# Altium schematic sheet Etapa_Regulación.schdoc
size 160 x 68 mm
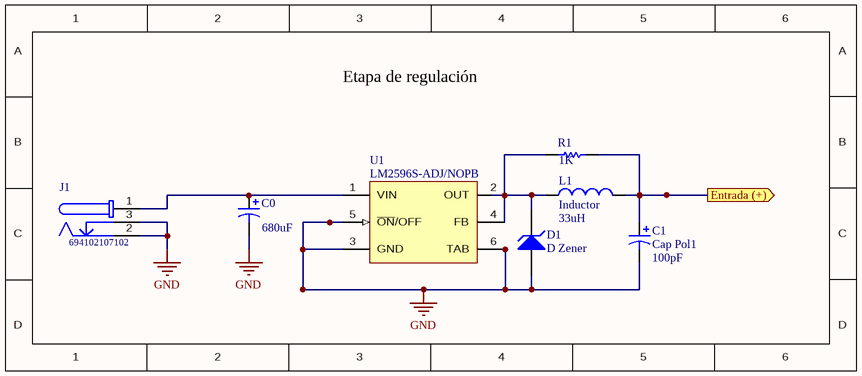
[diagram p0: Etapa_Regulación.schdoc]

## Parts
C0  value 680uF  [RB7.6-15]  (hidden comment: Cap Pol1)
C1  Cap Pol1  value 100pF  [RB7.6-15]
D1  D Zener  [DIODE-0.7]
J1  694102107102  [694102107102]
L1  Inductor  value 33uH  [0402-A]
R1  value 1K  [AXIAL-0.3]  (hidden comment: Res1)
U1  LM2596S-ADJ/NOPB  [KTT0005B_N]

## Ports
Entrada (+) (out)

## Nets
GND: C0.2 C1.2 D1.1(A) J1.2 J1.3 U1.3(GND) U1.5(~{ON}/OFF) U1.6(TAB)
Entrada (+): C1.1 L1.2 R1.2 ; port Entrada (+)
NetC0_1: C0.1 J1.1 U1.1(VIN)
NetD1_2: D1.2(K) L1.1 R1.1 U1.2(OUT) U1.4(FB)

## Notes on the sheet
- Etapa de regulación

## Library data of the parts
C0 C1 = Cap Pol1: Polarized Capacitor (Radial); Published: 8-Jun-2000; LatestRevisionDate: 17-Jul-2002; LatestRevisionNote: Re-released for DXP Platform.; PackageReference: RB7.6-15; Publisher: Altium Limited; PackageDescription: Polarized Capacitor (Radial); 2 Leads
D1 = D Zener: Zener Diode; Published: 8-Jun-2000; LatestRevisionDate: 17-Jul-2002; LatestRevisionNote: Re-released for DXP Platform.; PackageReference: DIODE-0.7; Publisher: Altium Limited; PackageDescription: Diode, Thru-Hole; 2 Leads; 0.7 in Pin Spacing
J1 = CMP-1502-00174-1: DC Power Jack Connector Low Profile with 4 soldering pads & Pegs WR-DC, Male, Right Angled, SMT, 5 A, 18 V; Manufacturer: Wurth Elektronik; Working Voltage: 18V; Rated Current: 5A; Plug Outer Diameter: 3.5mm; Plug Inner Diameter: 1.05mm; Opening Diameter: 3.9mm; Manufacturer URL: http://www.we-online.de; Publisher: WurthElektronik; Gender: Male; Mounting Technology: SMT; Packaging: TapeandReel; Package Reference: 694102107102; Part Number: 694102107102; Operating Temperature: -40to85degC; Datasheet URL: http://katalog.we-online.de/em/datasheet/6941xx107102.pdf; Orientation: RightAngled
L1 = Inductor: Code_IEC: 1005; Published: 8-Jun-2000; LatestRevisionDate: 29-May-2009; LatestRevisionNote: IPC-7351 Footprint Added.; PackageReference: 0402-A; Publisher: Altium Limited; PackageDescription: Chip Inductor; Code_JEITA: 0402
R1 = Res1: Resistor; Published: 8-Jun-2000; LatestRevisionDate: 17-Jul-2002; LatestRevisionNote: Re-released for DXP Platform.; PackageReference: AXIAL-0.3; Publisher: Altium Limited; PackageDescription: Axial Device, Thru-Hole; 2 Leads; 0.3 in Pin Spacing
U1 = CMP-0069-00271-3: SIMPLE SWITCHER® Power Converter 150 KHz 3A Step-Down Voltage Regulator, 5-pin TO-263, Pb-Free; Manufacturer: Texas Instruments; PowerWise: N; PackageTopMarking: NSUZXYTTE#*LM2596S*-ADJ P+; ComponentLink1Description: Datasheet URL; PackageDescription: TO-263, Molded, .400 x .390 x .180in, 5 Lead, .067in Pitch, Surface Mount; ComponentLink1URL: http://www.ti.com/general/docs/lit/getliterature.tsp?genericPartNumber=LM2596&fileType=pdf; Code_JEDEC: MO-169-AB; PinCount: 5; CompType: Switcher; PackageReference: KTT0005B; RoHS: Y